# Altium project counter_using_CD4026BE.PrjPcb
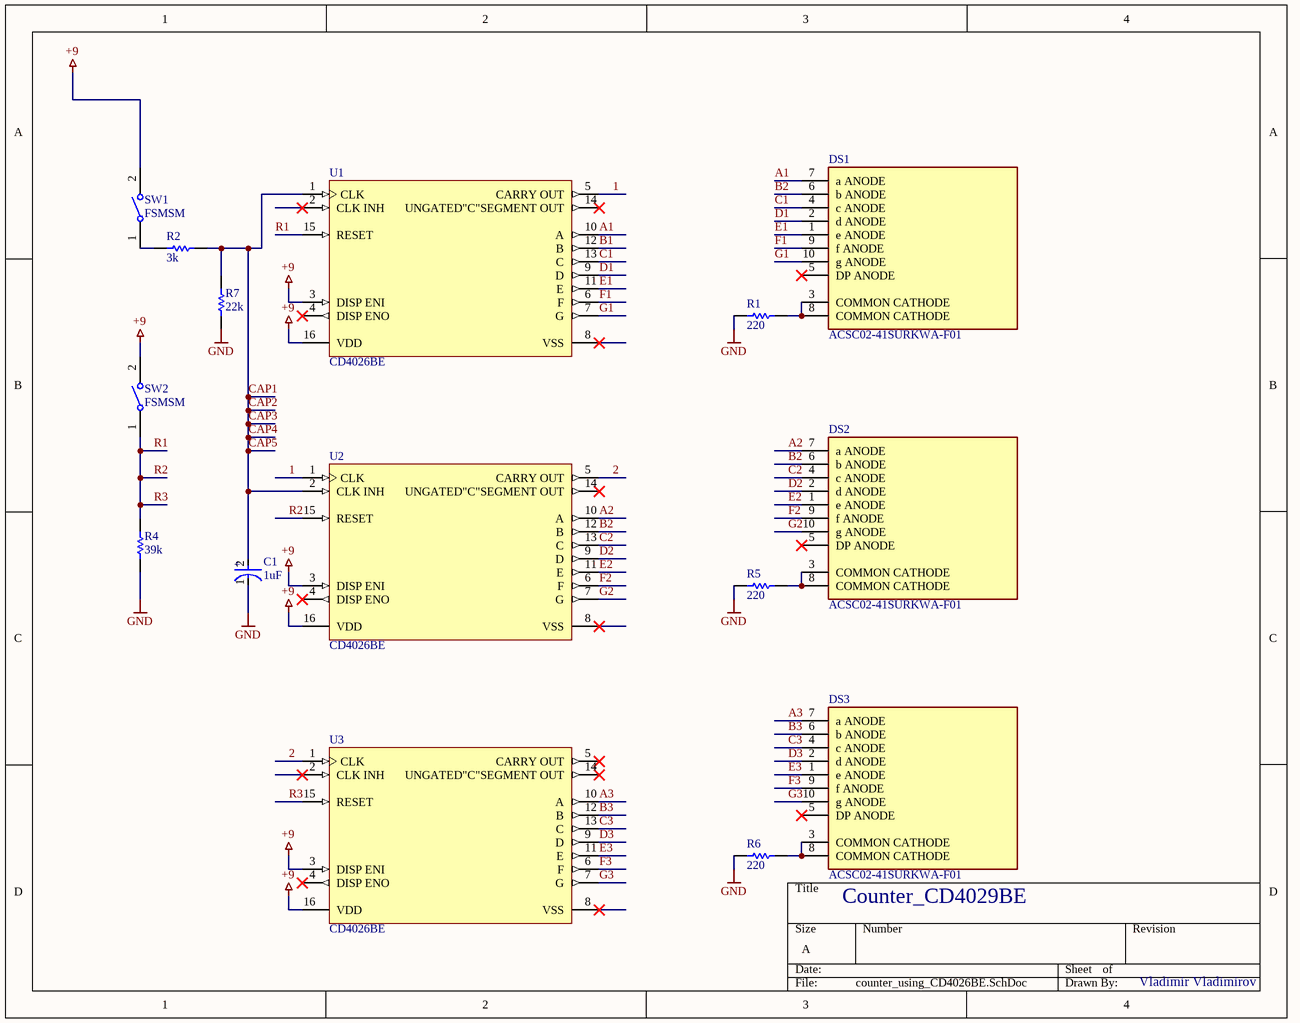
[diagram p0: counter_using_CD4026BE.SchDoc]
1 sheet, 15 parts. Net scope: global (net labels, ports and power ports of the same name join across sheets).
Board file: counter_using_CD4026BE.PcbDoc

## Sheet counter_using_CD4026BE.SchDoc
size A; SheetNumber: 1; SheetTotal: 1

### Parts
C1  1uF  [FP-FCB-MFG]
DS1  ACSC02-41SURKWA-F01  [FP-ACSC02-41SURKWA-F01-MFG]
DS2  ACSC02-41SURKWA-F01  [FP-ACSC02-41SURKWA-F01-MFG]
DS3  ACSC02-41SURKWA-F01  [FP-ACSC02-41SURKWA-F01-MFG]
R1  220  [RESC2013X70X40NL20T20]
R2  3k  [RESC2013X70X40NL20T20]
R4  39k  [RESC2013X70X40NL20T20]
R5  220  [RESC2013X70X40NL20T20]
R6  220  [RESC2013X70X40NL20T20]
R7  22k  [RESC2013X70X40NL20T20]
SW1  FSMSM  [TECO-FSMSM-2_V]
SW2  FSMSM  [TECO-FSMSM-2_V]
U1  CD4026BE  [N0016A]
U2  CD4026BE  [N0016A]
U3  CD4026BE  [N0016A]

### Nets
+9: SW1.2 SW2.2 U1.3(DISP_ENI) U1.16(VDD) U2.3(DISP_ENI) U2.16(VDD) U3.3(DISP_ENI) U3.16(VDD)
GND: C1.1(C) R1.1 R4.1 R5.2 R6.2 R7.1
1: U1.5(CARRY_OUT) U2.1(CLK)
2: U2.5(CARRY_OUT) U3.1(CLK)
A1: DS1.7(a_ANODE) U1.10(A)
A2: DS2.7(a_ANODE) U2.10(A)
A3: DS3.7(a_ANODE) U3.10(A)
B1: U1.12(B)
B2: DS1.6(b_ANODE) DS2.6(b_ANODE) U2.12(B)
B3: DS3.6(b_ANODE) U3.12(B)
C1: DS1.4(c_ANODE) U1.13(C)
C2: DS2.4(c_ANODE) U2.13(C)
C3: DS3.4(c_ANODE) U3.13(C)
CAP1: C1.2(A) R2.2 R7.2 U1.1(CLK) U2.2(CLK_INH)  [also labelled CAP2, CAP3, CAP4, CAP5]
D1: DS1.2(d_ANODE) U1.9(D)
D2: DS2.2(d_ANODE) U2.9(D)
D3: DS3.2(d_ANODE) U3.9(D)
E1: DS1.1(e_ANODE) U1.11(E)
E2: DS2.1(e_ANODE) U2.11(E)
E3: DS3.1(e_ANODE) U3.11(E)
F1: DS1.9(f_ANODE) U1.6(F)
F2: DS2.9(f_ANODE) U2.6(F)
F3: DS3.9(f_ANODE) U3.6(F)
G1: DS1.10(g_ANODE) U1.7(G)
G2: DS2.10(g_ANODE) U2.7(G)
G3: DS3.10(g_ANODE) U3.7(G)
R1: R4.2 SW2.1 U1.15(RESET) U2.15(RESET) U3.15(RESET)  [also labelled R2, R3]
NetDS1_3: DS1.3(COMMON_CATHODE) DS1.8(COMMON_CATHODE) R1.2
NetDS2_3: DS2.3(COMMON_CATHODE) DS2.8(COMMON_CATHODE) R5.1
NetDS3_3: DS3.3(COMMON_CATHODE) DS3.8(COMMON_CATHODE) R6.1
NetR2_1: R2.1 SW1.1

Not connected (* = marked no-connect by the designer): DS1 5(DP_ANODE)*; DS2 5(DP_ANODE)*; DS3 5(DP_ANODE)*; U1 2(CLK_INH)* 4(DISP_ENO)* 8(VSS)* 14(UNGATED"C"SEGMENT_OUT)*; U2 4(DISP_ENO)* 8(VSS)* 14(UNGATED"C"SEGMENT_OUT)*; U3 2(CLK_INH)* 4(DISP_ENO)* 5(CARRY_OUT)* 8(VSS)* 14(UNGATED"C"SEGMENT_OUT)*

### Notes on the sheet
- (near DS3) Counter_CD4029BE
- Vladimir Vladimirov
- (in symbol CMP-00287-05440591-1) +

### Library data of the parts
C1 = CMP-00287-05440591-1: EEEFC1H1R0R Aluminum Electrolytic Capacitor, 1 uF, 50 V, ± 20%, 1000 hours @ 105°C, Radial Can - SMD; Lead Length: 1.8mm; Dielectric Material: Aluminium; Ripple Current (AC): 30mA; Voltage: 50V; Impedance: 5Ω; Capacitance: 1µF; Leakage Current: 3µA; Diameter: 4mm; Mount: PCB, Surface Mount; Width: 4.3mm; Height - Seated (Max): 5.4102mm; Contact Plating: Tin; Height: 5.4mm; Number of Pins: 2; RoHS: Compliant; Tolerance: 20%; Ripple Current: 30mA; Life (Hours): 1000hours; Voltage Rating (AC): 50V; Length: 5.5mm; Schedule B: 8532220020, 8532220020; Material: Aluminium; Voltage Rating: 50V; Min Operating Temperature: -40°C; Voltage Rating (DC): 50V; REACH SVHC: No SVHC; ESR (Equivalent Series Resistance): 5Ω; Lead Pitch: 1mm; Lead Free: Lead Free; Packaging: Cut Tape; Radiation Hardening: No; Lifecycle Status: Production; NexarPartId: 5440591; Max Operating Temperature: 105°C; Case/Package: Radial; Termination: SMD/SMT
DS1-DS3 = CMP-44525-000002-1: DISPLAY 7-SEG 0.2" SGL RED 10SMD; Element Configuration: Common Cathode; Operating Supply Voltage: 1.95V; Wavelength: 630nm; Power Consumption: 75mW; Number of Characters: 1; Forward Current: 30mA; Test Current: 20mA; Luminous Intensity: 30mcd; Min Operating Temperature: -40°C; Package Quantity: 650; Height: 0.315inch; Packaging: Tape and Reel; Width: 0.272inch; Max Power Dissipation: 75mW; Color: Red; Illumination Color: Red; Lead Free: Lead Free; Case/Package: SMD/SMT; Max Operating Temperature: 85°C; Forward Voltage: 1.95V
R1 R2 R4-R7 = CMP-2001-00044-1: Part Number: ERJ6ENF2200V; Manufacturer: Panasonic
SW1 SW2 = CMP-2000-07511-1: FSMSM Push Button Switch, 50 mA, -35 to 85 degC, 2-Pin SMD, RoHS, Bulk; Manufacturer: TE Connectivity; Actuator Length: 1.07mm; Electrical Life: 20000Cycles; Actuator Material: Polyamide; Current Rating: 50mA; Illumination Type: Illuminated; Voltage Rating (DC): 24V; Contact Resistance: 100mOhm; Case\/Package: SMD/SMT; Operating Force: 180gf; Switch Travel: 0.25mm; Max Voltage Rating (DC): 12V; Throw Configuration: SPST; Packaging: LoosePiece; Max Operating Temperature: 85degC; ELV: Compliant; Package Description: 2-Pin Surface Mount Device, Body 6 x 3.5 mm, Pitch 9.19 mm; RoHSCompliant: true; Manufacturer URL: http://www.te.com/; Contact Plating: Silver; Contact Material: Brass; Mounting Technology: SurfaceMount; Contact Current Rating: 50mA; Datasheet Version: Rev. C2, 08/2014; Datasheet URL: http://www.te.com/commerce/DocumentDelivery/DDEController?Action=showdoc&DocId=Customer+Drawing%7F1437566-3%7FC2%7Fpdf%7FEnglish%7FENG_CD_1437566-3_C2_1437566_3_1_c.dwg.pdf%7F1437566-3; Mechanical Life: 20000Cycles; Package Reference: FSMSM; REACH SVHC: Unknown; Orientation: Straight; Min Operating Temperature: -35degC; Lead Free: LeadFree; Termination: GullWing; Package Quantity: 1000; Mount: SurfaceMount
U1-U3 = CMP-1623-00561-2: CMOS Decade Counter/Divider with Decoded 7-Segment Display Outputs and Display Enable, N0016A, TUBE; Manufacturer: Texas Instruments; ICC @ Nom Voltage(Max)(mA): 0.03; tpd @ Nom Voltage(Max)(ns): 250; F @ Nom Voltage(Max)(Mhz): 8; Bits(#): 7; VCC(Max)(V): 18; VCC(Min)(V): 3; Output Drive (IOL/IOH)(Max)(mA): 1.5/-1.5; Inputs: 1; Rating: Catalog; Technology Family: CD4000; Schmitt Trigger: No; Voltage(Nom)(V): 5,10,15; DatasheetVersion: SCHS031B; Operating Temperature Range(C): -55 to 125; Code_JEDEC: MS-001; Input Type: CMOS; Output Type: CMOS; Type: Decade; Generic Part Number: CD4026B; PackageReference: N0016A; Function: Counter